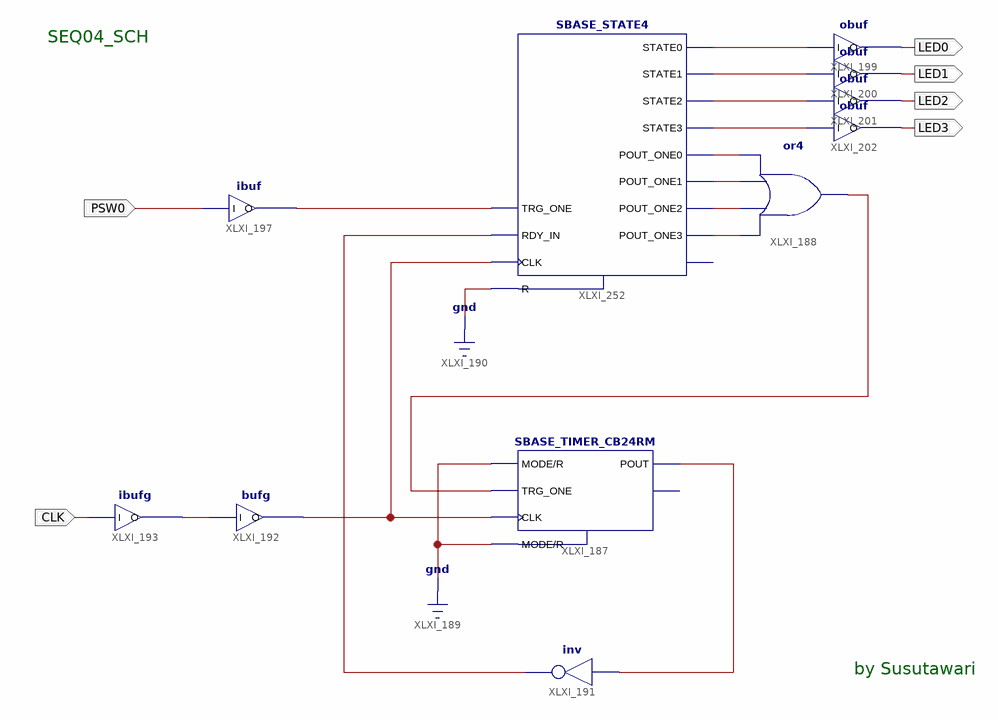
[diagram p0: schematic sheet 1]
// Xilinx ISE schematic SEQ04_SCH.sch (spartan3e) as structural Verilog: 11 symbols, 6 ports
module SEQ04_SCH (
  input  CLK,
  input  PSW0,
  output LED0,
  output LED1,
  output LED2,
  output LED3
);

  wire XLXN_731, XLXN_732, XLXN_733, XLXN_734, XLXN_735, XLXN_740, XLXN_742, XLXN_744, XLXN_745, XLXN_777,
       XLXN_778, XLXN_779, XLXN_780, XLXN_781;

  SBASE_TIMER_CB24RM XLXI_187 (
    .CLK(XLXN_744), .TRG_ONE(XLXN_735), .MODE(1'b0), .POUT(XLXN_740), .R(1'b0));  // open: RDY_ONE
  or XLXI_188 (XLXN_735, XLXN_731, XLXN_732, XLXN_733, XLXN_734);
  not XLXI_191 (XLXN_742, XLXN_740);
  bufg XLXI_192 (.I(XLXN_745), .O(XLXN_744));
  ibufg XLXI_193 (.I(CLK), .O(XLXN_745));
  obuf XLXI_202 (.I(XLXN_780), .O(LED3));
  obuf XLXI_201 (.I(XLXN_779), .O(LED2));
  obuf XLXI_200 (.I(XLXN_778), .O(LED1));
  obuf XLXI_199 (.I(XLXN_777), .O(LED0));
  ibuf XLXI_197 (.I(PSW0), .O(XLXN_781));
  SBASE_STATE4 XLXI_252 (
    .CLK(XLXN_744), .RDY_IN(XLXN_742), .TRG_ONE(XLXN_781), .POUT_ONE0(XLXN_734), .POUT_ONE1(XLXN_733),
    .POUT_ONE2(XLXN_732), .POUT_ONE3(XLXN_731), .STATE0(XLXN_777), .STATE1(XLXN_778), .STATE2(XLXN_779),
    .STATE3(XLXN_780), .R(1'b0));  // open: RDY

  // Notes on the sheet:
  //   SEQ04_SCH
  //   by Susutawari
endmodule
